# EAGLE design ce2 (EAGLE 8.2.0)
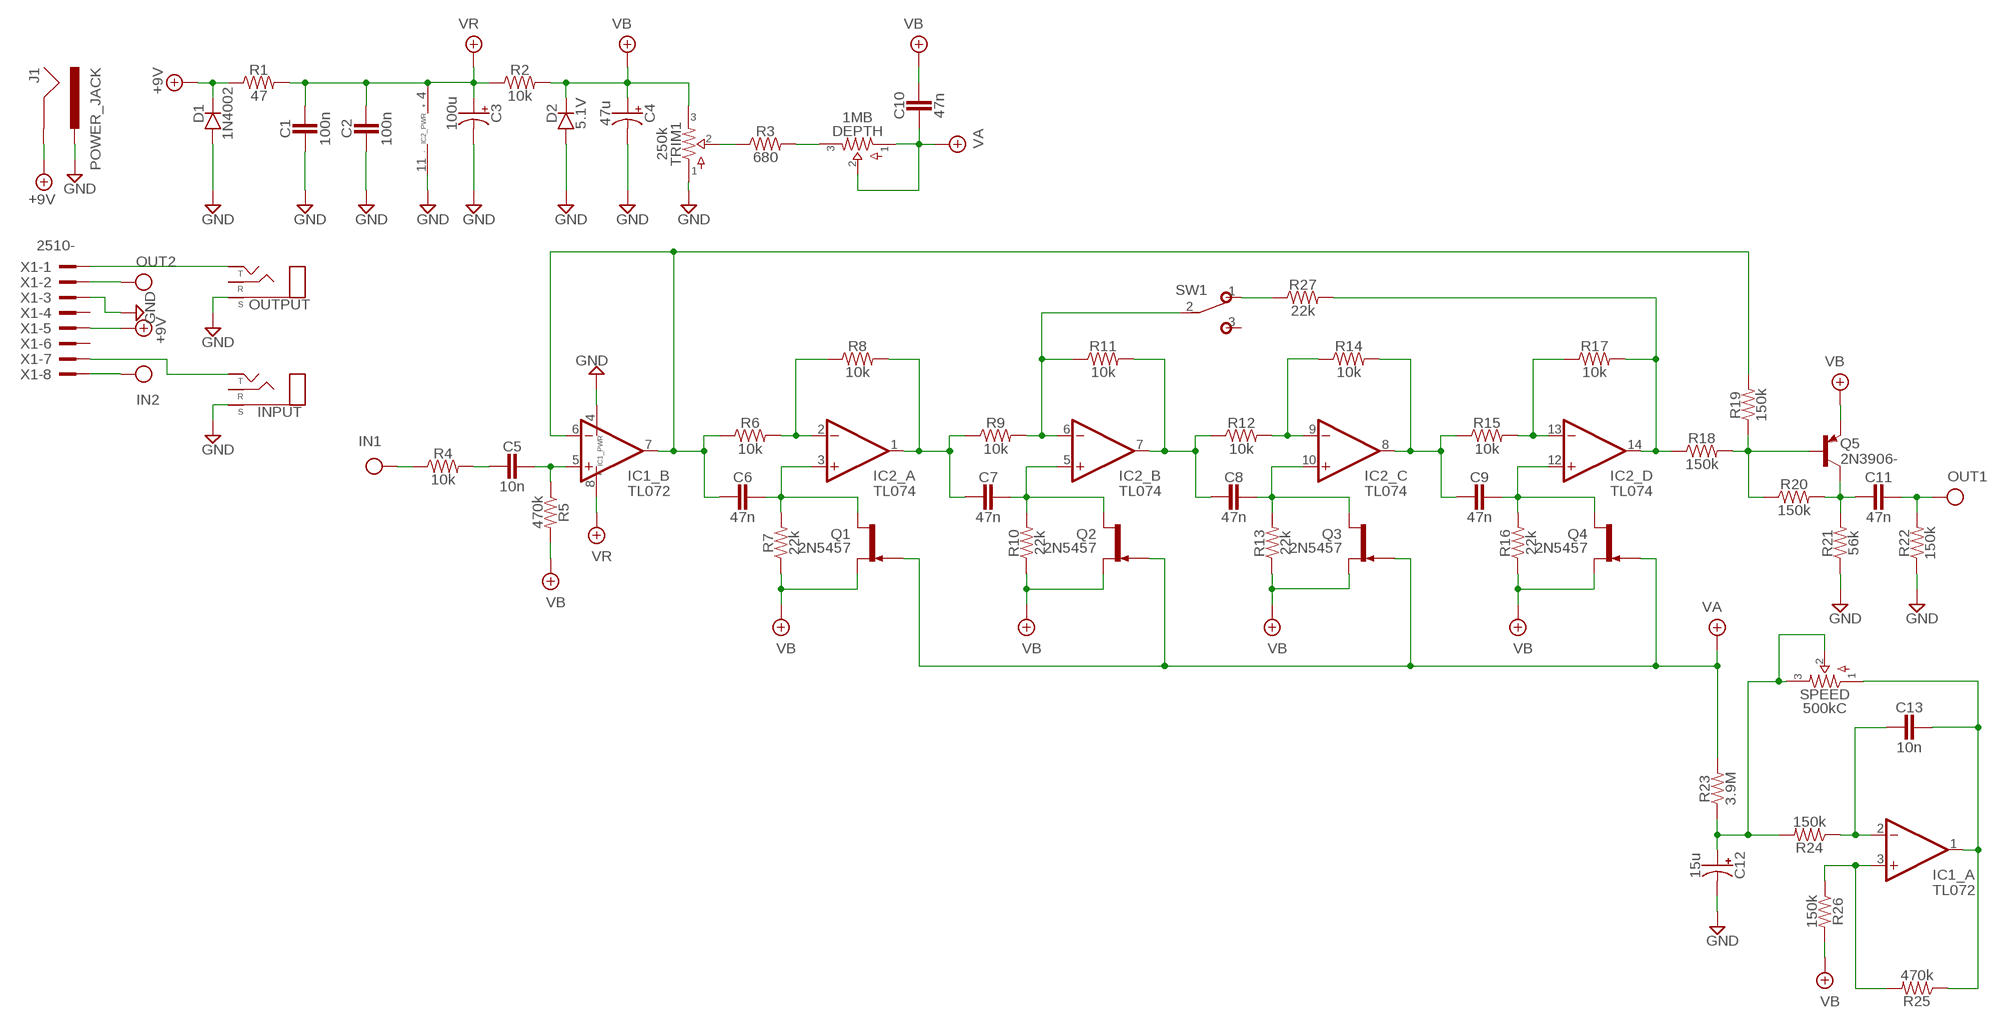
[diagram p0: schematic, sheet 1]

## Parts
C1  100n  CER/FILM2  [050X030_025_2]
C2  100n  CER/FILM2  [050X030_025_2]
C3  100u  0500  [050_020]
C4  47u  0500  [050_020]
C5  10n  CER/FILMBOX.1  [BOX_SMALL]
C6  47n  CER/FILMBOX.1  [BOX_SMALL]
C7  47n  CER/FILMBOX.1  [BOX_SMALL]
C8  47n  CER/FILMBOX.1  [BOX_SMALL]
C9  47n  CER/FILMBOX.1  [BOX_SMALL]
C10  47n  CER/FILMBOX.1  [BOX_SMALL]
C11  47n  CER/FILMBOX.1  [BOX_SMALL]
C12  15u  0501  [050_020_1]
C13  10n  CER/FILMBOX.1  [BOX_SMALL]
D1  1N4002  DO41.2  [DO41-2]
D2  5.1V  DO41.2  [DO41-2]
DEPTH  1MB  POTS16MM  [16MM]
IC1  TL072  DUALTH  [DIL0]
IC2  TL074  QUADTH  [DIL14]
INPUT  STEREONMJ  [NMJ6HCD2]
J1  POWER_JACK  [POWER_JACK_PTH]
OUTPUT  STEREONMJ  [NMJ6HCD2]
Q1  2N5457  [TO92-]
Q2  2N5457  [TO92-]
Q3  2N5457  [TO92-]
Q4  2N5457  [TO92-]
Q5  2N3906-  [TO92-]
R1  47  R_.3B  [R0207/3]
R2  10k  R_.3B  [R0207/3]
R3  680  R_.3B  [R0207/3]
R4  10k  R_.3B  [R0207/3]
R5  470k  R_.3B  [R0207/3]
R6  10k  R_.3B  [R0207/3]
R7  22k  R_.3B  [R0207/3]
R8  10k  R_.3B  [R0207/3]
R9  10k  R_.3B  [R0207/3]
R10  22k  R_.3B  [R0207/3]
R11  10k  R_.3B  [R0207/3]
R12  10k  R_.3B  [R0207/3]
R13  22k  R_.3B  [R0207/3]
R14  10k  R_.3B  [R0207/3]
R15  10k  R_.3B  [R0207/3]
R16  22k  R_.3B  [R0207/3]
R17  10k  R_.3B  [R0207/3]
R18  150k  R_.3B  [R0207/3]
R19  150k  R_.3B  [R0207/3]
R20  150k  R_.3B  [R0207/3]
R21  56k  R_.3B  [R0207/3]
R22  150k  R_.3B  [R0207/3]
R23  3.9M  R_.3B  [R0207/3]
R24  150k  R_.3B  [R0207/3]
R25  470k  R_.3B  [R0207/3]
R26  150k  R_.3B  [R0207/3]
R27  22k  R_.3B  [R0207/3]
SPEED  500kC  POTS16MM  [16MM]
SW1  SPDTPIN_MOUNT  [1MS1T1B1C0M2QE]
TRIM1  250k  POTSTEST  [RTRIM3296W]
X1  2510-  [PAK100/2500-10]

## Nets
+9V: D1.C J1.GND R1.1 X1.5
GND: C1.2 C2.2 C3.- C4.- C12.- D1.A D2.A IC1.4(_PWR:V-) IC2.11(_PWR:V-) INPUT.S J1.PWR OUTPUT.S R21.1 R22.1 TRIM1.1 X1.3
IN: R4.1 X1.8
N$1: R3.1 TRIM1.2
N$2: INPUT.T X1.7
N$3: DEPTH.3 R3.2
N$4: OUTPUT.T X1.1
N$5: C5.2 R4.2
N$6: C6.2 IC1.6(_B:-IN) IC1.7(_B:OUT) R6.1 R19.2
N$7: IC2.2(_A:-IN) R6.2 R8.1
N$8: C5.1 IC1.5(_B:+IN) R5.1
N$9: C6.1 IC2.3(_A:+IN) Q1.3(D) R7.2
N$10: C7.2 IC2.1(_A:OUT) R8.2 R9.1
N$11: R27.1 SW1.1(O)
N$12: IC2.6(_B:-IN) R9.2 R11.1 SW1.2(P)
N$13: C7.1 IC2.5(_B:+IN) Q2.3(D) R10.2
N$14: C8.2 IC2.7(_B:OUT) R11.2 R12.1
N$15: IC1.3(_A:+IN) R25.2 R26.1
N$16: IC2.9(_C:-IN) R12.2 R14.1
N$17: C8.1 IC2.10(_C:+IN) Q3.3(D) R13.2
N$18: C9.2 IC2.8(_C:OUT) R14.2 R15.1
N$19: C13.1 IC1.1(_A:OUT) R25.1 SPEED.1
N$20: IC2.13(_D:-IN) R15.2 R17.1
N$21: C9.1 IC2.12(_D:+IN) Q4.3(D) R16.2
N$22: IC2.14(_D:OUT) R17.2 R18.1 R27.2
N$24: Q5.2(B) R18.2 R19.1 R20.1
N$25: C11.2 Q5.1(C) R20.2 R21.2
N$26: C13.2 IC1.2(_A:-IN) R24.1
N$27: C12.+ R23.1 R24.2 SPEED.2 SPEED.3
OUT: C11.1 R22.2 X1.2
VA: C10.2 DEPTH.1 DEPTH.2 Q1.1(G) Q2.1(G) Q3.1(G) Q4.1(G) R23.2
VB: C4.+ C10.1 D2.C Q1.2(S) Q2.2(S) Q3.2(S) Q4.2(S) Q5.3(E) R2.2 R5.2 R7.1 R10.1 R13.1 R16.1 R26.2 TRIM1.3
VR: C1.1 C2.1 C3.+ IC1.8(_PWR:V+) IC2.4(_PWR:V+) R1.2 R2.1
Unconnected: INPUT.R OUTPUT.R SW1.3(S) X1.4 X1.6

## Library data of the parts
C1 C2 C5-C11 C13 = pedals-capacitors-film:CER/FILM: 47 - 120pF Xicon Ceramic Disc 2.5mm lead spacing
C3 C4 C12 = pedals-capacitors-elec:050
D1 D2 = pedals-diodes:DO41: DO-41 Package Diodes: 1N4001 - 1N40019 Zener Diodes: 1N4728 - 1N4764
DEPTH SPEED TRIM1 = pedals-potentiometers:POTS
IC1 = pedals-integrated circuits:DUAL: OP AMP
IC2 = pedals-integrated circuits:QUAD: OP AMP
INPUT OUTPUT = pedals-jacks:STEREO
J1 = pedals-jacks:POWER_JACK: Power Jack Connector This is the standard 5.5mm barrel jack for power. The PTH is the most common, proven, reliable, footprint. The Slot footprint only works if the mill layer is transmitted to the PCB fab house so be warned. Here are the connectors we sell at SparkFun: DC Barrel Power Jack/Connector <https://www.sparkfun.com/products/119> (PRT-00119) DC Barrel Power Jack/Connector (SMD) <https://www.sparkfun.com/products/12748> (PRT-12748) DC Barrel Jack Adapter - Breadboard Compatible <https://www.sparkfun.com/products/10811> (PRT-10811) It is used on this SparkFun product (and many, many others): SparkFun RedBoard - Programmed with Arduino <https://www.sparkfun.com/products/12757> (DEV-12757) Also, if you need a mating power supply or connector, please check these out: Wall Adapter Power Supply - 9VDC 650mA <https://www.sparkfun.com/products/298> (TOL-00298) DC Barrel Jack Adapter - Male <https://www.sparkfun.com/products/10287> (PRT-10287); PROD_ID: CONN-08197
Q1-Q4 = pedals-transistors:2N5457: N-CHANNEL JFET
Q5 = pedals-transistors:2N3906: PNP Transistor
R1-R27 = pedals-resistors:R_
SW1 = pedals-switches:SPDT: TOGGLE SWITCH Marquardt
X1 = pedals-headers:2510-: 3M (TM) Pak 100 4-Wall Header Source: 3M; MF: 3M; MPN: 2510-6002UB; OC_FARNELL: 9838244; OC_NEWARK: 46F4725

## Board
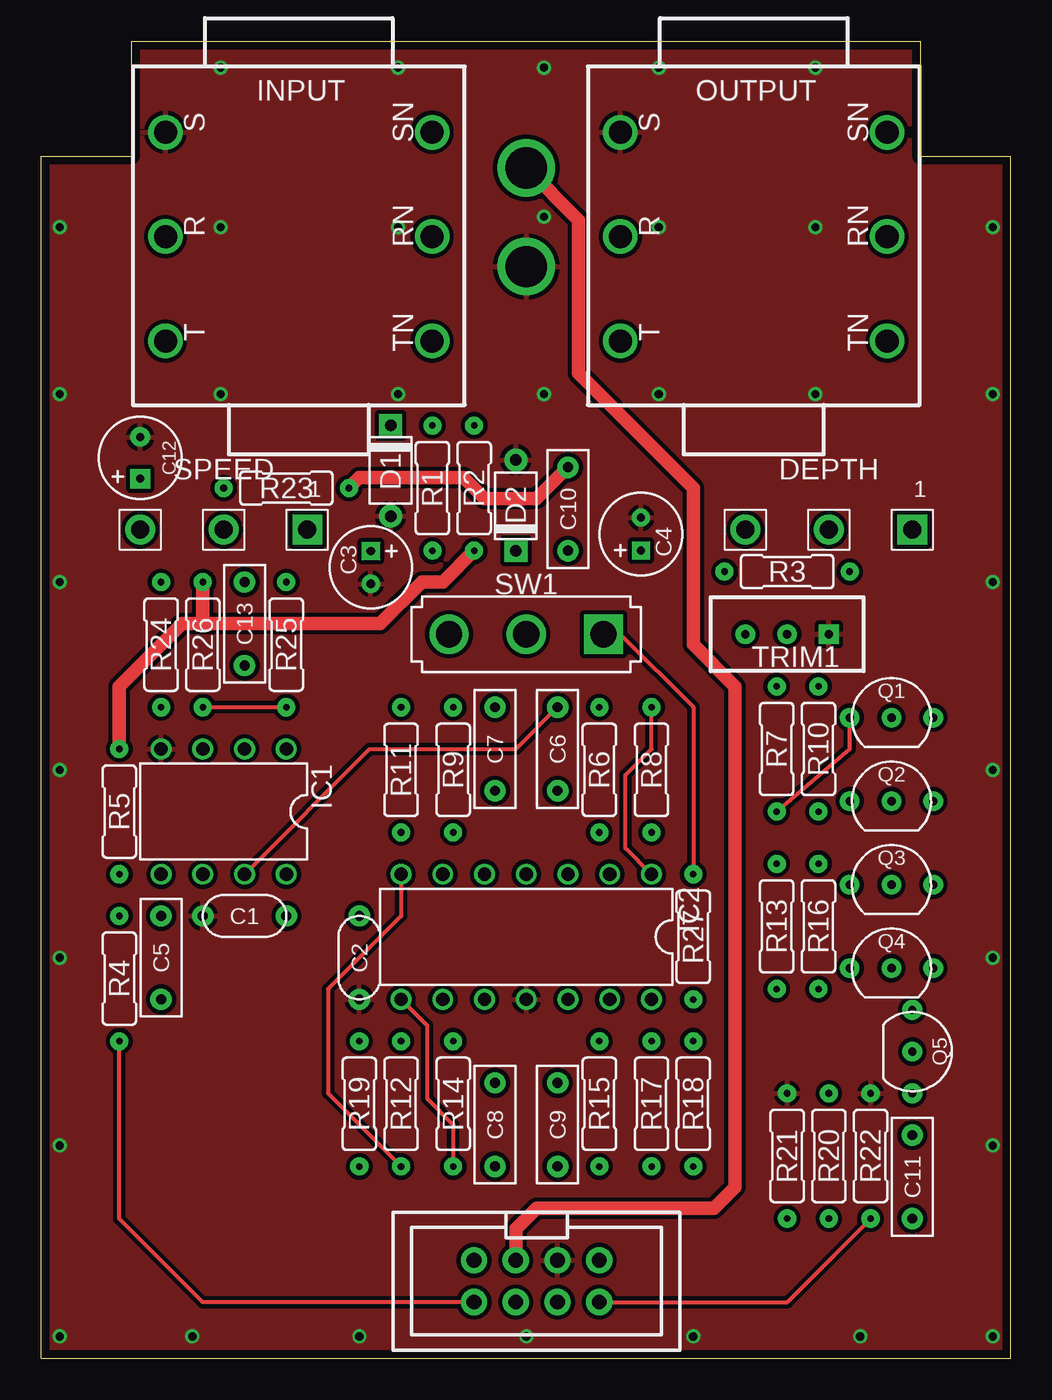
[diagram p1: board, top side]
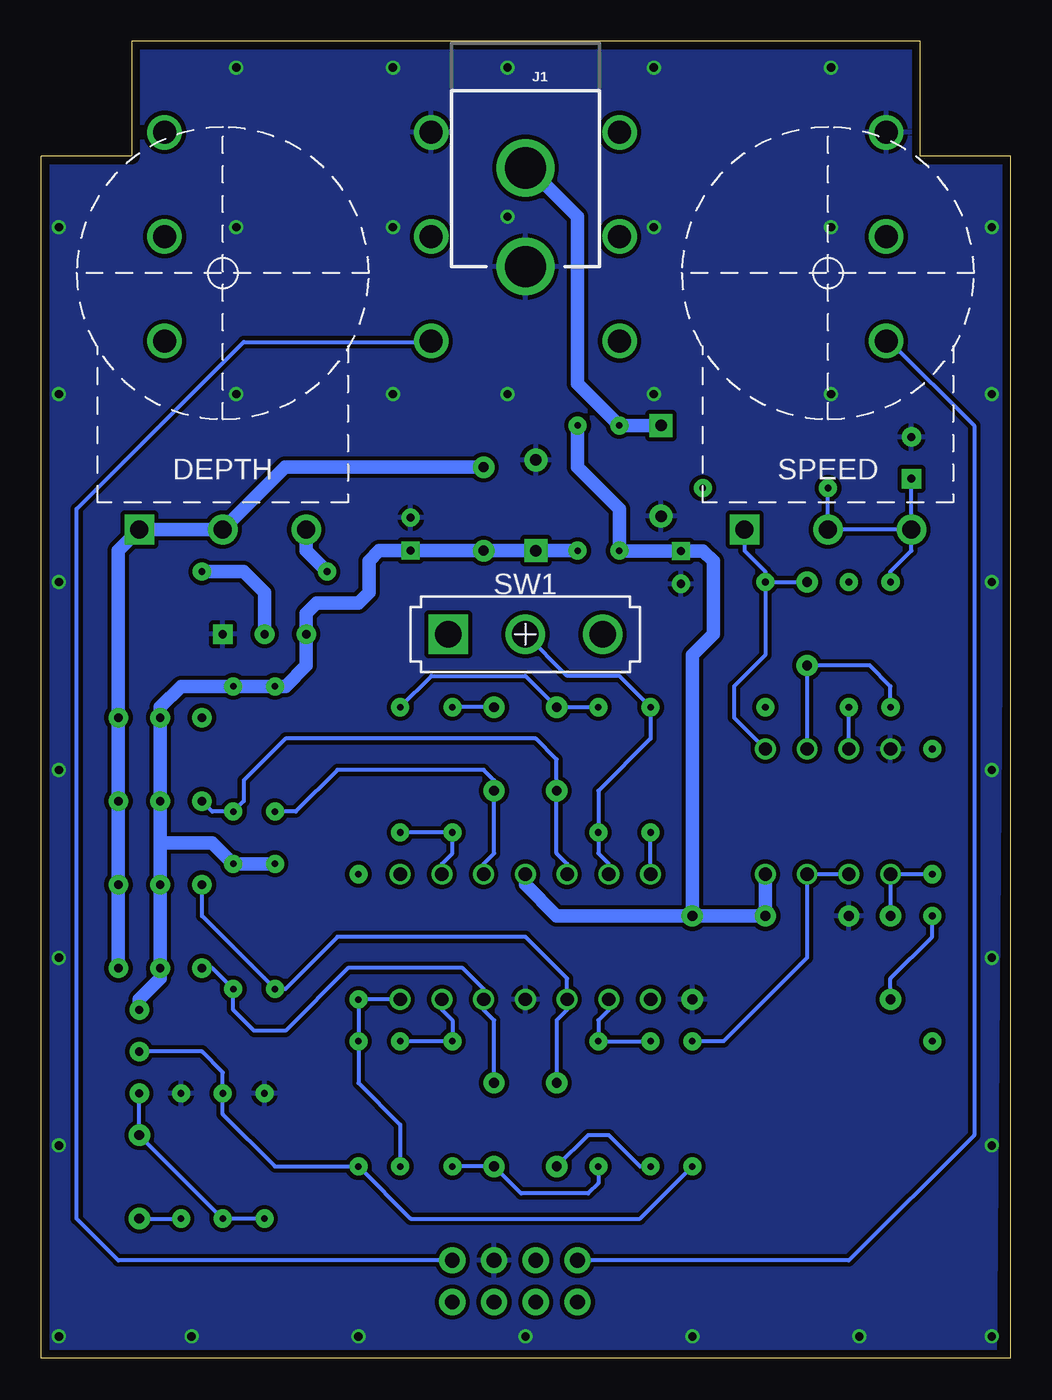
[diagram p2: board, bottom side, seen from below]

Size 59 x 80.16 mm. Coordinates in mm from the lower left corner, seen from the top.
Copper layers (1*16): Top 0.035mm / dielectric 1.6mm / Bottom 0.035mm
Design rules "Elecrow_2-layer_PCB_eagle_rule": minimum track width 6mil, minimum drill 12mil, track to track 6mil, track to pad 6mil, pad to pad 6mil, via to via 8mil, smd to smd 0mil, copper to edge 20mil, drill to drill 10mil, minimum pad ring 6mil, minimum via ring 6mil, stop-mask expansion 0mil, vias tented up to drill 100mil, thermal gap 10mil

### Footprints (pad centres in the part's own frame; a part is rotated, then mirrored left to right if it is on the bottom)
050X030_025_2 = drill 0.6 pad 1.3: 1 -2.54,0; 2 2.54,0
050_020 = drill 0.5 pad 1.1 square: + -0.998,0.001 | drill 0.5 pad 1.1: - 0.998,0.001
BOX_SMALL = drill 0.6 pad 1.3: 1 -2.54,0; 2 2.54,0
050_020_1 = drill 0.5 pad 1.2 square: + -1.27,0 | drill 0.5 pad 1.2: - 1.27,0
DO41-2 = drill 0.7 pad 1.4: A 2.794,0 | drill 0.7 pad 1.4 square: C -2.731,0
16MM = drill 1.1 pad 1.8 square: 1 5.08,-1 | drill 1.1 pad 1.8: 2 0,-1; 3 -5.08,-1
DIL0 = drill 0.813 pad 1.27: 1 -3.81,-3.81; 2 -1.27,-3.81; 3 1.27,-3.81; 4 3.81,-3.81; 5 3.81,3.81; 6 1.27,3.81; 7 -1.27,3.81; 8 -3.81,3.81
DIL14 = drill 0.813 pad 1.27: 1 -7.62,-3.81; 2 -5.08,-3.81; 3 -2.54,-3.81; 4 0,-3.81; 5 2.54,-3.81; 6 5.08,-3.81; 7 7.62,-3.81; 8 7.62,3.81; 9 5.08,3.81; 10 2.54,3.81; 11 0,3.81; 12 -2.54,3.81; 13 -5.08,3.81; 14 -7.62,3.81
NMJ6HCD2 = drill 1.4: R 0,8.115; RN 0,-8.115; S 6.35,8.115; SN 6.35,-8.115; T -6.35,8.115; TN -6.35,-8.115
POWER_JACK_PTH = drill 2.5: GND 0,7.7; PWR 0,13.7
TO92- = drill 0.5 pad 1.2: 1 2.54,0; 2 0,0; 3 -2.54,0
R0207/3 = drill 0.4 pad 1.1: 1 -3.81,0; 2 3.81,0
1MS1T1B1C0M2QE = drill 1.6 square: 1 4.699,0 | drill 1.6: 2 0,0; 3 -4.699,0
RTRIM3296W = drill 0.5 pad 1.2 square: 1 0,-2.54 | drill 0.5 pad 1.2: 2 0,0; 3 0,2.54
PAK100/2500-10 = drill 0.9 pad 1.6: 1 -3.81,-1.27; 2 -3.81,1.27; 3 -1.27,-1.27; 4 -1.27,1.27; 5 1.27,-1.27; 6 1.27,1.27; 7 3.81,-1.27; 8 3.81,1.27

### Placement (x,y rotation side)
C1  12.38,26.92 180 top
C2  19.37,24.38 270 top
C3  20.07,48.13 270 top
C4  36.51,50.16 90 top
C5  7.3,24.38 270 top
C6  31.43,37.08 90 top
C7  27.62,37.08 90 top
C8  27.62,14.22 270 top
C9  31.43,14.22 270 top
C10  32.07,51.69 90 top
C11  53.02,11.05 90 top
C12  6.03,54.8 90 top
C13  12.38,44.7 270 top
D1  21.27,54.04 270 top
D2  28.89,51.88 90 top
DEPTH  47.94,51.43 0 top
IC1  11.11,33.27 180 top
IC2  29.53,25.65 180 top
INPUT  15.68,68.26 90 top
J1  29.53,80.14 180 bottom
OUTPUT  43.37,68.26 90 top
Q1  51.75,38.99 0 top
Q2  51.75,33.91 0 top
Q3  51.75,28.83 0 top
Q4  51.75,23.75 0 top
Q5  53.02,18.67 270 top
R1  23.81,52.96 270 top
R2  26.35,52.96 270 top
R3  45.4,47.88 180 top
R4  4.76,23.11 90 top
R5  4.76,33.27 90 top
R6  33.97,35.81 270 top
R7  44.77,37.08 270 top
R8  37.15,35.81 90 top
R9  25.08,35.81 270 top
R10  47.31,37.08 270 top
R11  21.91,35.81 270 top
R12  21.91,15.49 90 top
R13  44.77,26.29 270 top
R14  25.08,15.49 270 top
R15  33.97,15.49 90 top
R16  47.31,26.29 270 top
R17  37.15,15.49 270 top
R18  39.69,15.49 270 top
R19  19.37,15.49 90 top
R20  47.94,12.32 270 top
R21  45.4,12.32 270 top
R22  50.48,12.32 270 top
R23  14.92,52.96 0 top
R24  7.3,43.43 90 top
R25  14.92,43.43 270 top
R26  9.84,43.43 90 top
R27  39.69,25.65 270 top
SPEED  11.11,51.43 0 top
SW1  29.53,44.07 0 top
TRIM1  45.4,44.07 90 top
U$2  [125B_PCB_HUGE]  0,-7.62 0 top  (outside the outline)
X1  30.16,4.7 180 top

### Tracks (layer width: path | path; a pad name or v marks a point on that pad's centre or on a via)
+9V
  Top 0.813: X1.5 28.89,7.87 30.16,9.14 40.96,9.14 42.23,10.41 42.23,40.89 39.69,43.43 39.69,52.96 32.7,59.94 32.7,69.27 J1.GND
  Bottom 0.813: D1.C R1.1 26.35,59.31 26.35,69.47 29.33,72.44 J1.GND
GND  (via drill 0.5 pad 0.85)
  other vias: 57.91,68.83 57.91,58.67 10.92,78.55 21.72,78.55 30.61,78.55 1.14,58.67 10.92,68.83 10.92,58.67 21.72,58.67 30.61,69.47 30.61,58.67 37.59,78.55 47.12,78.55 37.59,68.83 37.59,58.67 47.12,68.83 47.12,58.67 57.91,47.24 57.91,35.81 57.91,24.38 57.91,12.95 57.91,1.33 49.85,1.33 39.69,1.33 29.53,1.33 19.37,1.33 9.21,1.33 1.14,1.33 1.14,68.83 1.14,47.24 1.14,35.81 1.14,24.38 1.14,12.95 21.72,68.83
  pour Bottom (isolate 0.254): 0.32,79.63 58.74,79.63 59.37,-0.38 0.95,-0.38
  pour Top (isolate 0.254): -0.32,-0.38 59.37,-0.38 59.37,80.9 -0.32,80.9
IN
  Top 0.254: X1.8 9.84,3.43 4.76,8.51 R4.1
N$1
  Bottom 0.813: TRIM1.2 45.4,46.61 46.67,47.88 R3.1
N$2
  Bottom 0.254: INPUT.T 7.37,61.91 2.22,56.77 2.22,13.59 9.84,5.97 X1.7
N$3
  Bottom 0.813: R3.2 42.86,49.15 DEPTH.3
N$4
  Bottom 0.254: X1.1 54.29,5.97 56.83,8.51 56.83,51.69 46.67,61.85 35.32,61.85 OUTPUT.T
N$5
  Bottom 0.254: C5.2 7.3,23.11 4.76,25.65 R4.2
N$6
  Top 0.254: IC1.7 20,37.08 28.89,37.08 C6.2
  Bottom 0.254: C6.2 R6.1 | IC1.6 IC1.7 12.38,24.38 17.46,19.3 R19.2
N$7
  Bottom 0.254: IC2.2 34.61,30.1 33.97,30.73 R6.2 R8.1
N$8
  Bottom 0.254: R5.1 IC1.5 C5.1
N$9
  Top 0.254: R7.2 49.21,37.08 Q1.3
  Bottom 0.254: IC2.3 32.07,30.1 31.43,30.73 C6.1 31.43,35.18 32.07,35.81 40.96,35.81 43.5,33.27 R7.2
N$10
  Top 0.254: IC2.1 35.56,31.05 35.56,35.5 37.15,37.08 R8.2
  Bottom 0.254: R9.1 C7.2 29.53,41.53 35.24,41.53 R8.2
N$11
  Top 0.254: SW1.1 35.24,44.07 39.69,39.62 R27.1
N$12
  Bottom 0.254: IC2.6 24.45,30.1 25.08,30.73 R9.2 25.08,34.54 21.91,37.72 R11.1 23.81,41.53 26.99,41.53 SW1.2
N$13
  Bottom 0.254: IC2.5 26.99,30.1 27.62,30.73 C7.1 27.62,36.45 28.89,37.72 44.13,37.72 46.67,35.18 46.67,33.91 R10.2 48.58,33.27 Q2.3
N$14
  Top 0.254: IC2.7 21.91,26.92 17.46,22.48 17.46,16.13 R12.1
  Bottom 0.254: IC2.7 R11.2 | R12.1 22.54,11.68 24.45,13.59 25.72,13.59 C8.2
N$15
  Top 0.254: R26.1 R25.2
  Bottom 0.254: IC1.3 R26.1
N$16
  Bottom 0.254: IC2.9 24.45,21.21 25.08,20.57 R14.1 R12.2
N$17
  Bottom 0.254: C8.1 27.62,20.57 26.99,21.21 IC2.10 26.99,23.11 29.53,25.65 40.96,25.65 44.13,22.48 R13.2 49.21,26.92 Q3.3
N$18
  Top 0.254: R14.2 25.08,14.22 23.49,15.81 23.49,20.26 IC2.8
  Bottom 0.254: R15.1 C9.2 29.78,10.03 25.72,10.03 25.08,10.67 R14.2
N$19
  Bottom 0.254: SPEED.1 16.19,49.15 14.92,47.88 R25.1 | R25.1 C13.1 | R25.1 14.92,42.8 16.83,40.89 16.83,38.99 IC1.1
N$20
  Bottom 0.254: IC2.13 34.61,21.21 33.97,20.57 R15.2 R17.1
N$21
  Bottom 0.254: C9.1 31.43,20.57 32.07,21.21 IC2.12 32.07,22.48 33.34,23.75 40.32,23.75 44.13,19.94 46.04,19.94 47.31,21.21 R16.2 48.58,23.75 Q4.3
N$22
  Bottom 0.254: IC2.14 R27.2 R18.1 39.69,16.76 37.15,14.22 R17.2
N$24
  Bottom 0.254: Q5.2 49.21,18.67 47.94,17.4 R20.1 47.94,14.86 44.77,11.68 R18.2 36.51,8.51 22.54,8.51 R19.1
N$25
  Bottom 0.254: Q5.1 C11.2 R20.2 R21.2
N$26
  Bottom 0.254: R24.1 7.3,40.89 8.57,42.16 C13.2 IC1.2
N$27
  Bottom 0.254: SPEED.3 C12.+ | SPEED.3 SPEED.2 R23.1 | R24.2 7.3,47.88 6.03,49.15 SPEED.3
OUT
  Top 0.254: X1.2 45.4,3.43 R22.2
  Bottom 0.254: C11.1 R22.2
VA
  Top 0.813: R23.2 19.37,53.59 25.72,53.59 26.99,52.32 30.16,52.32 C10.2
  Bottom 0.813: Q4.1 Q3.1 Q2.1 Q1.1 54.29,49.16 DEPTH.1 DEPTH.2 44.15,54.23 C10.2
VB
  Top 0.813: R2.2 24.45,47.24 23.18,47.24 20.64,44.7 9.84,44.7 | R5.2 4.76,40.89 8.57,44.7 9.84,44.7 | R26.2 9.84,44.7
  Bottom 0.813: 51.75,31.37 Q2.2 Q1.2 51.75,39.62 50.48,40.89 R10.1 R7.1 44.13,40.89 42.86,42.16 42.86,44.03 42.84,44.05 TRIM1.3 42.86,45.34 42.23,45.97 39.69,45.97 39.05,46.61 39.05,48.51 38.42,49.15 36.53,49.15 C4.+ 36.49,49.15 C10.1 D2.C R2.2 | 51.75,31.37 Q3.2 Q4.2 51.75,23.11 53.02,21.84 Q5.3 | R13.1 R16.1 48.58,31.37 51.75,31.37
VR
  Bottom 0.813: IC2.4 29.53,28.83 27.62,26.92 C2.1 | C2.1 19.37,42.8 18.1,44.07 18.1,48.51 18.71,49.13 C3.+ 23.79,49.13 R1.2 23.81,51.69 26.35,54.23 R2.1 | C2.1 C1.1 IC1.8